# EasyEDA Pro project 2025新M0板子工程.eprj, board PCB1
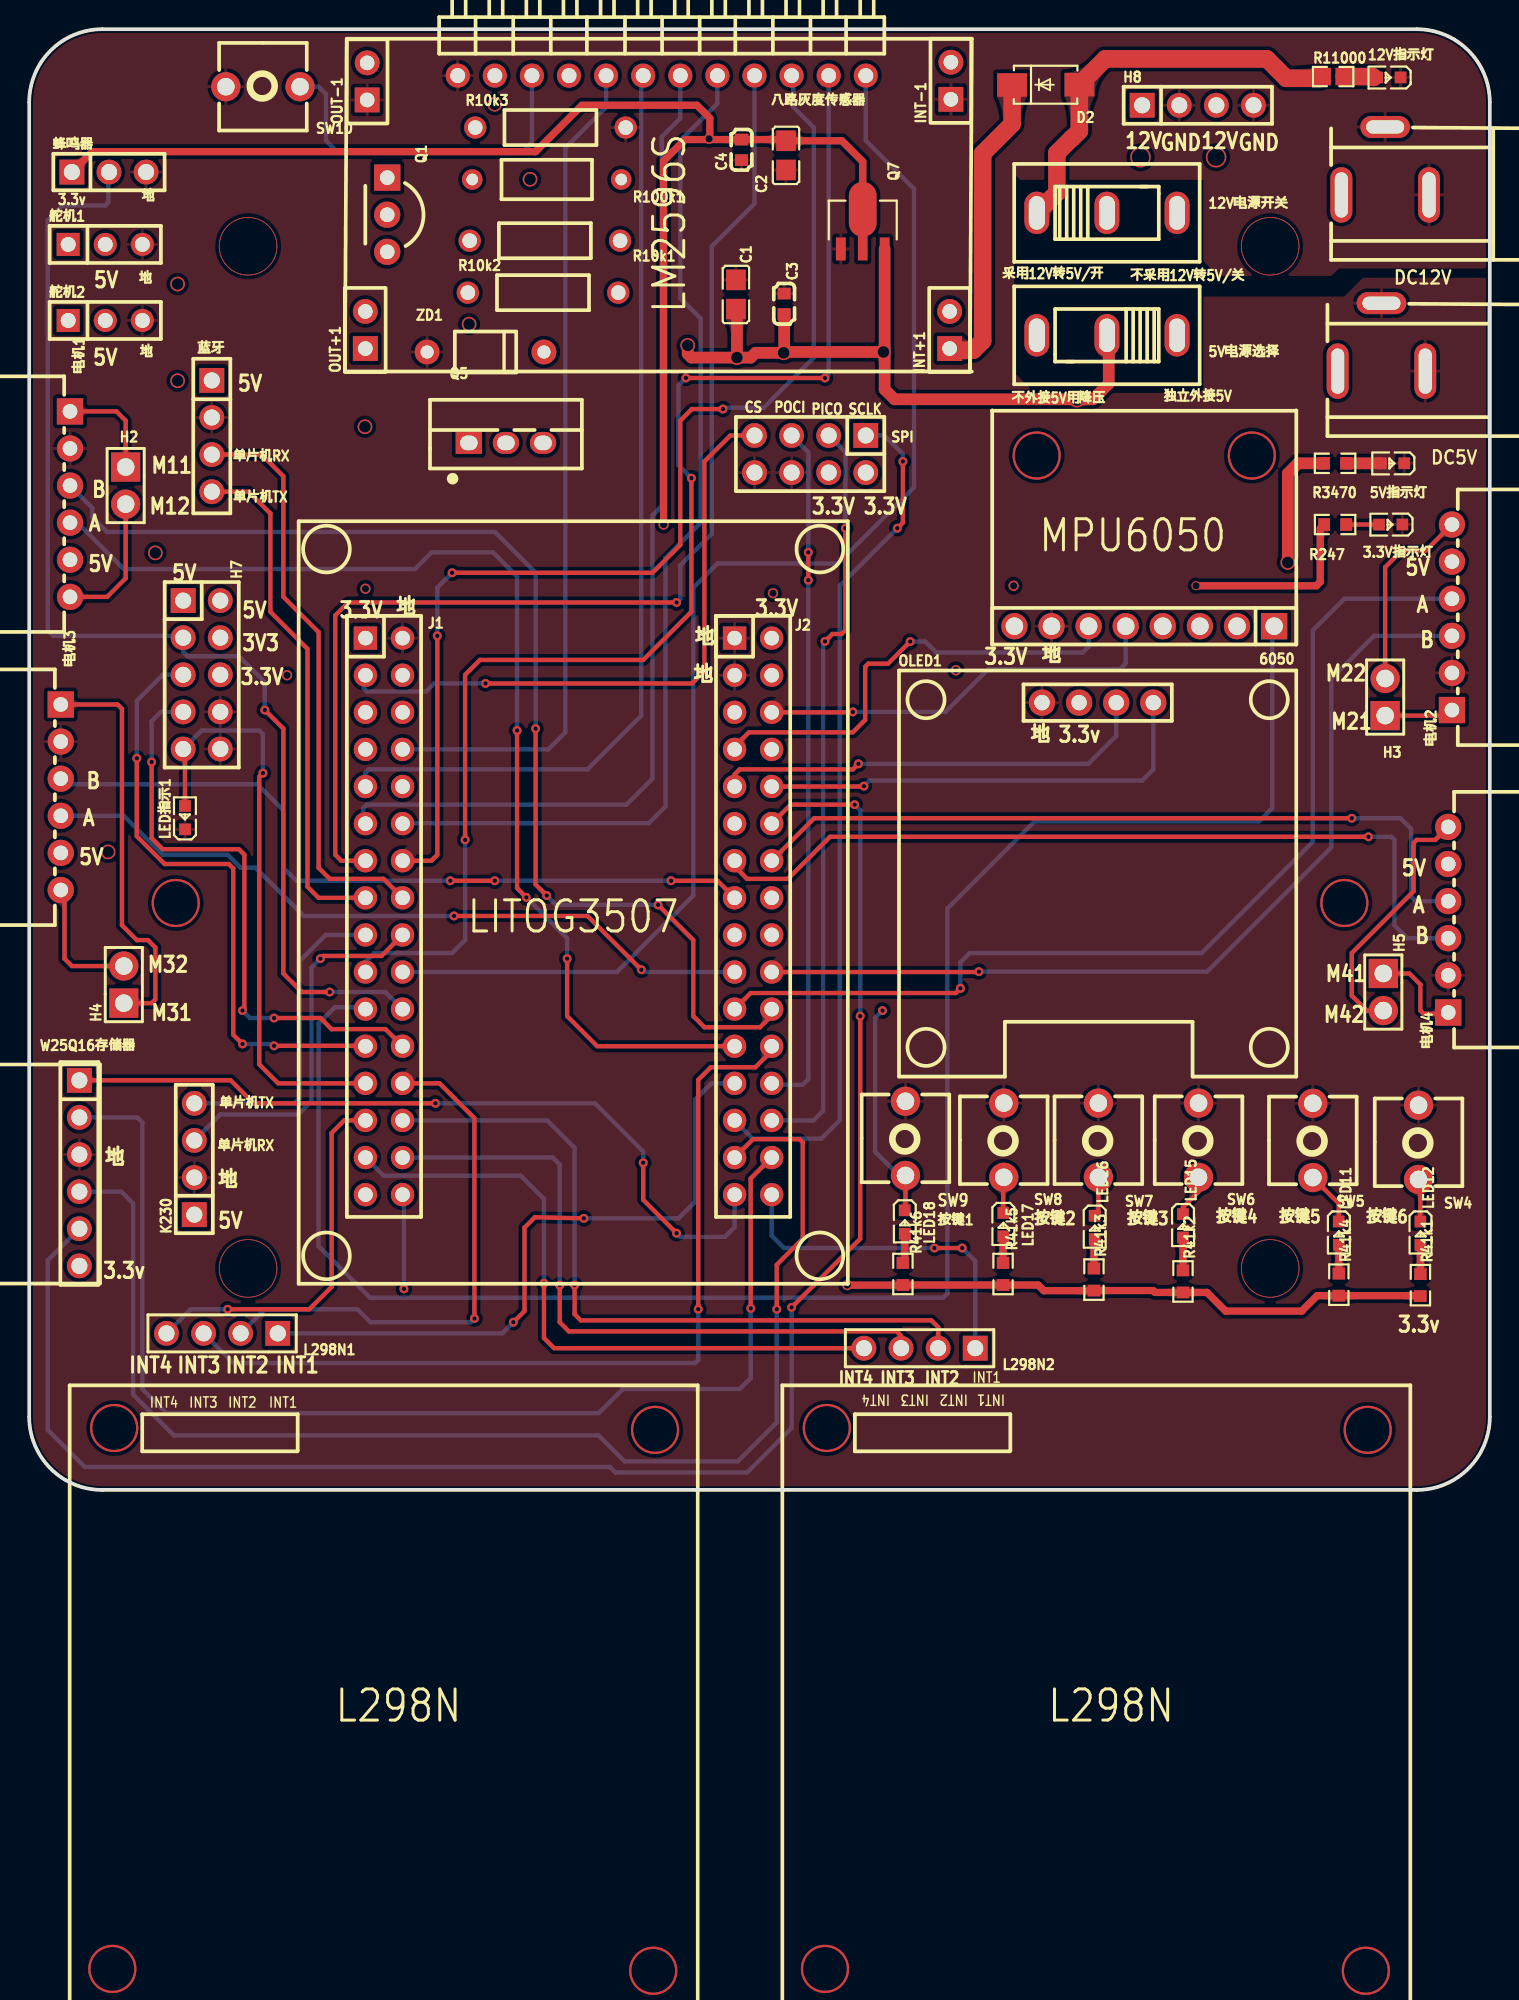
[diagram p1: board, top side]
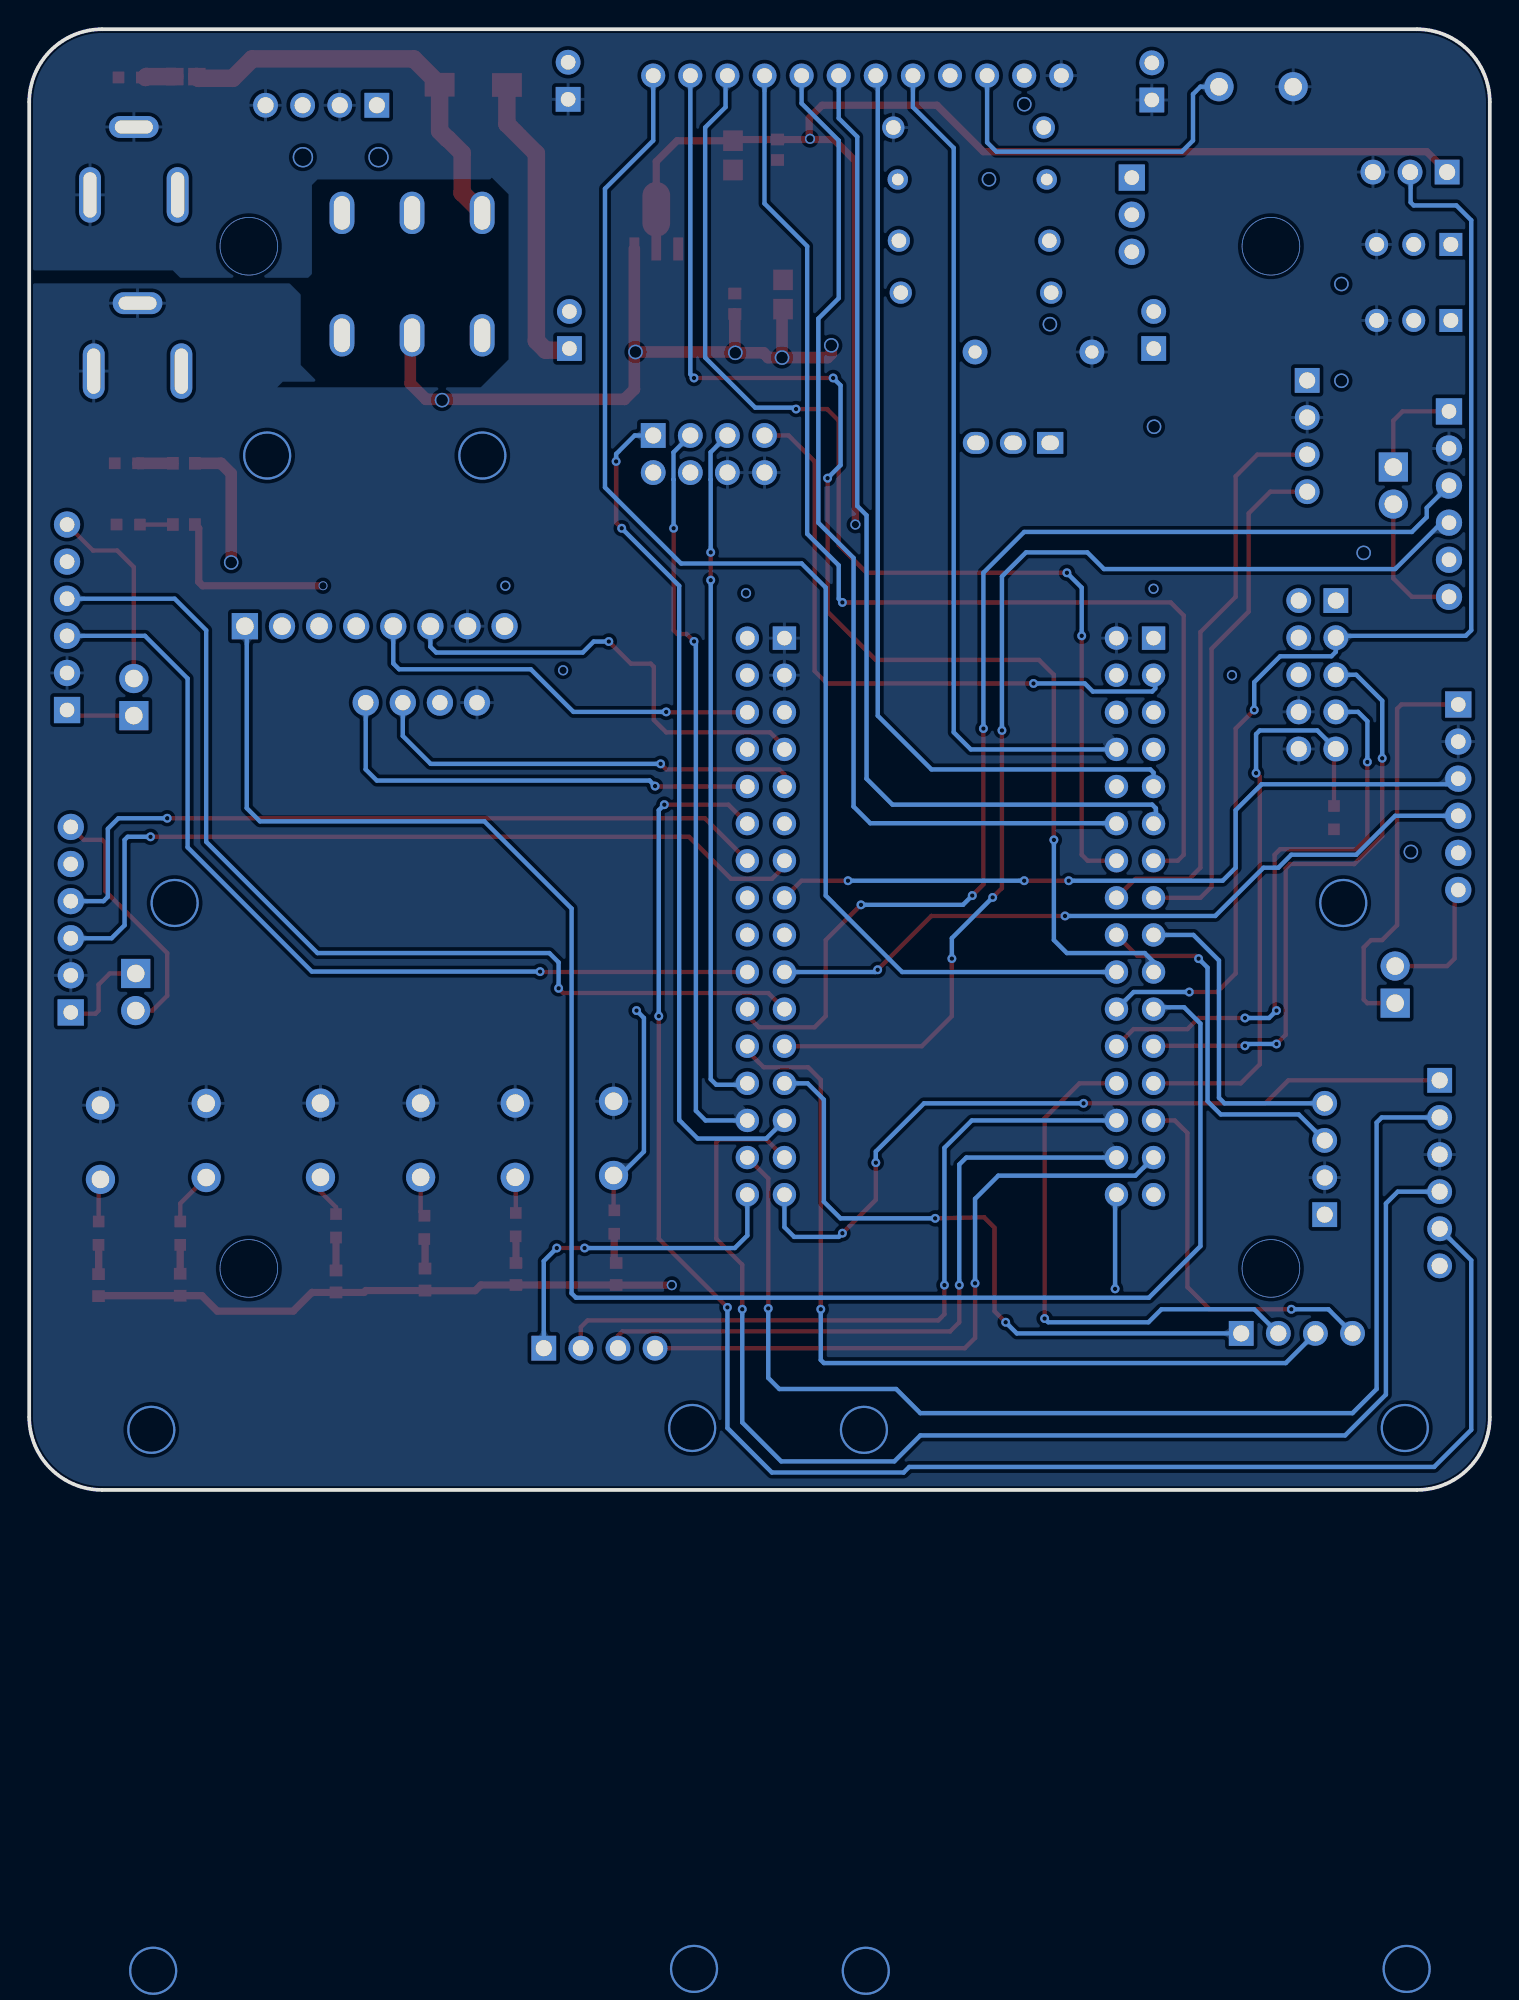
[diagram p2: board, bottom side, seen from below]

Outline 100 x 100 mm; copper layers: Top Layer, Inner1, Inner2, Bottom Layer. Coordinates in mm from the lower left corner of the outline.
Outline path: 0,95 0,5 arc(1.46,1.46) 5,0 95,0 arc(98.54,1.46) 100,5 100,95 arc(98.54,98.54) 95,100 5,100 arc(1.46,98.54) 0,95
Stack: Top Layer 0.035mm 外层铜厚1oz / Dielectric1 0.2104mm 7628 RC49% 8.6mil / Inner1 0.0152mm 内层铜厚 / Dielectric2 1.065mm 1.1mm H/HOZ Copper / Inner2 0.0152mm 内层铜厚 / Dielectric3 0.2104mm 7628 RC49% 8.6mil / Bottom Layer 0.035mm 外层铜厚1oz

## Design rules (mm)
template: 自定义配置
spacing copperThickness1oz (default): track to track 0.102, other pairs 0.152 to 0.3
spacing copperThickness2oz: track to track 0.203, other pairs 0.152 to 0.3
track width copperThickness1oz (default): min 0.254, default 0.3, max 2.54
track width copperThickness2oz: min 0.203, default 0.254, max 2.54
differential pair differentialPair (default): width min 0.127, default 0.254, max 2.54; gap min 0.152, default 0.152
via viaSize (default): diameter min 0.5, default 0.61, max 10; hole min 0.3, default 0.305, max 6.3

## Placement (name value [footprint] x y rotation side)
3.3V指示灯  LTST-C191KSKT  [LED0603-RD-YELLOW]  93.22 66.09 180 top
5V指示灯  LTST-C191KSKT  [LED0603-RD-YELLOW]  93.34 70.28 180 top
5V电源选择  SS12D10G5  [SW-TH_SHOU-HAN_SS12D10G4]  73.79 79.05 180 top
12V指示灯  LTST-C191KSKT  [LED0603-RD-YELLOW]  93.09 96.7 180 top
12V电源开关  SS12D10G5  [SW-TH_SHOU-HAN_SS12D10G4]  73.79 87.43 0 top
6050  2.54-1*8P母环保  [HDR-TH_8P-P2.54-V-F-1]  76.34 59.13 180 top
C1  10uF  [C0805]  48.39 81.84 270 top
C2  10uF  [C0805]  51.82 91.36 90 top
C3  100nF  [C0603]  51.69 81.2 270 top
C4  100nF  [C0603]  48.77 91.75 90 top
D2  SS54  [SMA_L4.3-W2.6-LS5.0-FD]  69.6 96.19 180 top
DC5V  DC005-T25  [DC-IN-TH_DC-005-20A-1]  92.58 78.92 180 top
DC12V  DC005-T25  [DC-IN-TH_DC-005-20A-1]  92.84 90.98 180 top
H2  PZ254V-11-02P  [HDR-TH_2P-P2.54-V-M]  6.6 68.76 270 top
H3  PZ254V-11-02P  [HDR-TH_2P-P2.54-V-M]  92.84 54.28 90 top
H4  PZ254V-11-02P  [HDR-TH_2P-P2.54-V-M]  6.48 34.59 90 top
H5  PZ254V-11-02P  [HDR-TH_2P-P2.54-V-M]  92.71 34.09 270 top
H7  PZ254V-12-10P  [HDR-TH_10P-P2.54-V-M-R2-C5-S2.54]  11.81 55.8 270 top
H8  PZ254V-11-04P  [HDR-TH_4P-P2.54-V-M]  80.01 94.79 0 top
INT+1  2.54-1*2P母  [HDR-TH_2P-P2.54-V-F]  63.02 79.41 90 top
INT-1  2.54-1*2P母  [HDR-TH_2P-P2.54-V-F]  63.1 96.47 90 top
J1  X6521FV-2x16-C85D32  [HDR-TH_32P-P2.54-V-F-R2-C16-S2.54]  24.29 39.27 270 top
J2  X6521FV-2x16-C85D32  [HDR-TH_32P-P2.54-V-F-R2-C16-S2.54]  49.56 39.27 270 top
K230  PZ254V-11-04P  [HDR-TH_4P-P2.54-V-M]  11.3 22.66 90 top
L298N1  2.54-1*4  [HDR-TH_4P-P2.54-V-M-1]  13.21 10.72 180 top
L298N2  2.54-1*4  [HDR-TH_4P-P2.54-V-M-1]  60.96 9.7 180 top
LED11  LTST-C191KSKT  [LED0603-RD-YELLOW]  89.66 17.58 270 top
LED12  LTST-C191KSKT  [LED0603-RD-YELLOW]  95.25 17.58 270 top
LED15  LTST-C191KSKT  [LED0603-RD-YELLOW]  78.99 18.09 270 top
LED16  LTST-C191KSKT  [LED0603-RD-YELLOW]  72.95 17.97 270 top
LED17  LTST-C191KSKT  [LED0603-RD-YELLOW]  66.69 18.16 270 top
LED18  LTST-C191KSKT  [LED0603-RD-YELLOW]  59.94 18.34 270 top
LED指示1  LTST-C191KSKT  [LED0603-RD-YELLOW]  10.67 46.03 90 top
OLED1  HS96L03W2C03  [OLED-TH_L27.8-W27.2-P2.54_C9900033791]  73.15 53.9 0 top
OUT+1  2.54-1*2P母  [HDR-TH_2P-P2.54-V-F]  23.01 79.41 90 top
OUT-1  2.54-1*2P母  [HDR-TH_2P-P2.54-V-F]  23.14 96.43 90 top
Q1  SS8550DTA  [TO-92-3_L4.8-W3.7-P2.54-L]  24.51 87.3 270 top
Q5  HSP3119  [TO-220-3_L10.2-W4.5-P2.54-L-1]  32.64 71.68 0 top
Q7  AMS1117-3.3V  [SOT-89-3_L4.5-W2.5-P1.50-LS4.2-BR]  57.07 86.31 270 top
R10k1  10kΩ  [RES-TH_BD2.4-L6.3-P10.30-D0.6]  35.31 85.52 180 top
R10k2  10kΩ  [RES-TH_BD2.4-L6.3-P10.30-D0.6]  35.18 81.97 0 top
R10k3  10kΩ  [RES-TH_BD2.4-L6.3-P10.30-D0.6]  35.69 93.27 0 top
R41k1  1kΩ  [R0603]  95.25 14.02 270 top
R41k2  1kΩ  [R0603]  78.99 14.28 270 top
R41k3  1kΩ  [R0603]  72.9 14.4 270 top
R41k4  1kΩ  [R0603]  89.66 14.05 270 top
R41k5  1kΩ  [R0603]  66.68 14.78 270 top
R41k6  1kΩ  [R0603]  59.82 14.78 270 top
R100k1  100kΩ  [RES-TH_BD2.7-L6.2-P10.20-D0.4]  35.43 89.71 180 top
R247  470Ω  [R0603]  89.41 66.09 0 top
R3470  470Ω  [R0603]  89.41 70.28 0 top
R11000  470Ω  [R0603#2]  89.28 96.76 0 top
SPI  PZ254V-12-8P  [HDR-TH_8P-P2.54-V-M-R2-C4-S2.54]  53.47 70.92 180 top
SW4  K2-1104DZ-G4SW-04  [KEY-TH_2P-L6.0-W6.0-P5.00]  95.12 23.8 270 top
SW5  K2-1104DZ-G4SW-04  [KEY-TH_2P-L6.0-W6.0-P5.00]  87.88 23.93 270 top
SW6  K2-1104DZ-G4SW-04  [KEY-TH_2P-L6.0-W6.0-P5.00]  80.06 23.94 270 top
SW7  K2-1104DZ-G4SW-04  [KEY-TH_2P-L6.0-W6.0-P5.00]  73.2 23.94 270 top
SW8  K2-1104DZ-G4SW-04  [KEY-TH_2P-L6.0-W6.0-P5.00]  66.72 23.94 270 top
SW10  K2-1104DZ-G4SW-04  [KEY-TH_2P-L6.0-W6.0-P5.00]  16 96.06 180 top
W25Q16存储器  PZ254V-11-06P  [HDR-TH_6P-P2.54-V-M]  3.43 21.69 270 top
ZD1  1N4734A  [DO-41_BD2.8-L4.2-P8.00-D0.7-FD]  31.24 77.9 0 top
八路灰度传感器  2.54-1*12P反弯针  [HDR-TH_12P-P2.54-H-M-W10.5]  43.31 96.83 180 top
按键1  K2-1104DZ-G4SW-04  [KEY-TH_2P-L6.0-W6.0-P5.00]  59.99 24.07 270 top
电机1  XH-6AW  [CONN-TH_6P-P2.54_HCTL_XH-6AW_C2908615]  2.79 67.49 270 top
电机2  XH-6AW  [CONN-TH_6P-P2.54_HCTL_XH-6AW_C2908615]  97.41 59.74 90 top
电机3  XH-6AW  [CONN-TH_6P-P2.54_HCTL_XH-6AW_C2908615]  2.16 47.42 270 top
电机4  XH-6AW  [CONN-TH_6P-P2.54_HCTL_XH-6AW_C2908615]  97.16 39.04 90 top
舵机1  舵机  [HDR-TH_3P-P2.54-V-F]  5.21 85.27 0 top
舵机2  舵机  [HDR-TH_3P-P2.54-V-F]  5.21 80.06 0 top
蓝牙  2.54-1*4P母  [HDR-TH_4P-P2.54-V-F]  12.5 72.15 270 top
蜂鸣器  PZ254V-11-03P  [HDR-TH_3P-P2.54-V-M]  5.46 90.22 0 top

## Footprints (pads in the part's own frame, mm; a bottom-side part is the same pattern mirrored in y, then rotated)
C0603
  rect 0.8x0.9 smd: 1(-0.7,0) 2(0.7,0)
C0805
  rect 1.41x1.35 smd: 1(-1,0) 2(1,0)
CONN-TH_6P-P2.54_HCTL_XH-6AW_C2908615
  rect 1.8x1.8 hole 1: 1(-6.35,0)
  round 1.8 hole 1: 2(-3.81,0) 3(-1.27,0) 4(1.27,0) 5(3.81,0) 6(6.35,0)
DC-IN-TH_DC-005-20A-1
  oval 1.5x3.8 hole 0.9x3.1: 1(3,2.325) 2(-3,2.325)
  oval 3.4x1.5 hole 2.6x0.9: 3(0,-2.325)
DO-41_BD2.8-L4.2-P8.00-D0.7-FD
  round 1.7 hole 0.9: 1(-4,0) 2(4,0)
HDR-TH_2P-P2.54-V-F
  rect 1.7x1.7 hole 1: 1(-1.27,0)
  round 1.7 hole 1: 2(1.27,0)
HDR-TH_2P-P2.54-V-M
  rect 2x2 hole 1.2: 1(-1.27,0)
  round 2 hole 1.2: 2(1.27,0)
HDR-TH_3P-P2.54-V-F
  rect 1.575x1.575 hole 1.02: 1(-2.54,0)
  round 1.575 hole 1.02: 2(0,0) 3(2.54,0)
HDR-TH_3P-P2.54-V-M
  rect 1.7x1.7 hole 1.1: 1(-2.54,0)
  round 1.7 hole 1.1: 2(0,0) 3(2.54,0)
HDR-TH_4P-P2.54-V-F
  rect 1.7x1.7 hole 1.1: 1(-3.81,0)
  round 1.7 hole 1.1: 2(-1.27,0) 3(1.27,0) 4(3.81,0)
HDR-TH_4P-P2.54-V-M
  rect 1.7x1.7 hole 1.1: 1(-3.81,0)
  round 1.7 hole 1.1: 2(-1.27,0) 3(1.27,0) 4(3.81,0)
HDR-TH_4P-P2.54-V-M-1
  rect 1.7x1.7 hole 1.1: 1(-3.81,0)
  round 1.7 hole 1.1: 2(-1.27,0) 3(1.27,0) 4(3.81,0)
HDR-TH_6P-P2.54-V-M
  rect 1.7x1.7 hole 1.1: 1(-6.35,0)
  round 1.7 hole 1.1: 2(-3.81,0) 3(-1.27,0) 4(1.27,0) 5(3.81,0) 6(6.35,0)
HDR-TH_8P-P2.54-V-F-1
  rect 1.8x1.8 hole 1.2: 1(-8.89,0)
  round 1.8 hole 1.2: 2(-6.35,0) 3(-3.81,0) 4(-1.27,0) 5(1.27,0) 6(3.81,0) 7(6.35,0) 8(8.89,0)
HDR-TH_8P-P2.54-V-M-R2-C4-S2.54
  rect 1.7x1.7 hole 1.1: 1(-3.81,-1.27)
  round 1.7 hole 1.1: 2(-3.81,1.27) 3(-1.27,-1.27) 4(-1.27,1.27) 5(1.27,-1.27) 6(1.27,1.27) 7(3.81,-1.27) 8(3.81,1.27)
HDR-TH_10P-P2.54-V-M-R2-C5-S2.54
  rect 1.7x1.7 hole 1.1: 1(-5.08,-1.27)
  round 1.7 hole 1.1: 2(-5.08,1.27) 3(-2.54,-1.27) 4(-2.54,1.27) 5(0,-1.27) 6(0,1.27) 7(2.54,-1.27) 8(2.54,1.27) 9(5.08,-1.27) 10(5.08,1.27)
HDR-TH_12P-P2.54-H-M-W10.5
  round 1.65 hole 1.02: 1(-13.97,0) 2(-11.43,0) 3(-8.89,0) 4(-6.35,0) 5(-3.81,0) 6(-1.27,0) 7(1.27,0) 8(3.81,0) 9(6.35,0) 10(8.89,0) 11(11.43,0) 12(13.97,0)
HDR-TH_32P-P2.54-V-F-R2-C16-S2.54
  rect 1.6x1.6 hole 1: 1(-19.05,-1.27)
  round 1.6 hole 1: 2(-19.05,1.27) 3(-16.51,-1.27) 4(-16.51,1.27) 5(-13.97,-1.27) 6(-13.97,1.27) 7(-11.43,-1.27) 8(-11.43,1.27) 9(-8.89,-1.27) 10(-8.89,1.27) 11(-6.35,-1.27) 12(-6.35,1.27) 13(-3.81,-1.27) 14(-3.81,1.27) 15(-1.27,-1.27) 16(-1.27,1.27) 17(1.27,-1.27) 18(1.27,1.27) 19(3.81,-1.27) 20(3.81,1.27) 21(6.35,-1.27) 22(6.35,1.27) 23(8.89,-1.27) 24(8.89,1.27) 25(11.43,-1.27) 26(11.43,1.27) 27(13.97,-1.27) 28(13.97,1.27) 29(16.51,-1.27) 30(16.51,1.27) 31(19.05,-1.27) 32(19.05,1.27)
KEY-TH_2P-L6.0-W6.0-P5.00
  round 2 hole 1.2: 1(-2.54,0) 2(2.54,0)
LED0603-RD-YELLOW
  rect 0.8x0.8 smd: 1(-0.799,-0.004) 2(0.799,0.004)
OLED-TH_L27.8-W27.2-P2.54_C9900033791
  round 1.8 hole 1.05: 1(-3.81,0) 2(-1.27,0) 3(1.27,0) 4(3.81,0)
R0603
  rect 0.806x0.864 smd: 1(-0.753,0) 2(0.753,0)
R0603#2
  rect 1.2x1.2 smd: 1(-0.753,0) 2(0.753,0)
RES-TH_BD2.4-L6.3-P10.30-D0.6
  round 1.524 hole 1: 1(-5.15,0) 2(5.15,0)
RES-TH_BD2.7-L6.2-P10.20-D0.4
  round 1.4 hole 0.8: 1(-5.1,0) 2(5.1,0)
SMA_L4.3-W2.6-LS5.0-FD
  rect 2.046x1.62 smd: 1(-2.304,-0.009) 2(2.304,0.009)
SOT-89-3_L4.5-W2.5-P1.50-LS4.2-BR
  rect 1.575x0.672 smd: 1(1.356,-1.5) 3(1.356,1.5)
  custom 5.377x1.9 smd: 2(-1.356,0)
SW-TH_SHOU-HAN_SS12D10G4
  oval 1.7x2.9 hole 1.1x2.3: 1(-4.8,0) 2(0,0) 3(4.8,0)
TO-92-3_L4.8-W3.7-P2.54-L
  rect 1.8x1.8 hole 1: 1(-2.54,0)
  round 1.8 hole 1: 2(0,0) 3(2.54,0)
TO-220-3_L10.2-W4.5-P2.54-L-1
  rect 1.8x1.5 hole 1.2x1: 1(-2.54,0)
  oval 1.8x1.5 hole 1.2x1: 2(0,0) 3(2.54,0)

## Nets
As in the schematic, except:
3V3: 6050.8 C2.2 C4.2 H7.4 H7.6 J1.1 J2.2 OLED1.2 Q7.2 R41k1.2 R41k2.2 R41k3.2 R41k4.2 R41k5.2 R41k6.2 R247.1 SPI.2 SPI.4 W25Q16存储器.6 蜂鸣器.1
5V1: 5V电源选择.1 DC5V.1
12V: 12V电源开关.1 D2.1 R11000.1
GND: 3.3V指示灯.1 5V指示灯.1 12V指示灯.1 6050.7 C1.1 C2.1 C3.1 C4.1 DC5V.2 DC5V.3 DC12V.2 DC12V.3 H7.8 H7.10 H8.2 H8.4 INT-1.1 J1.2 J2.1 J2.3 K230.2 LED指示1.1 OLED1.1 OUT-1.1 Q7.1 R10k3.2 SPI.6 SPI.8 SW4.1 SW5.1 SW6.1 SW7.1 SW8.1 SW10.2 W25Q16存储器.3 ZD1.1 八路灰度传感器.12 按键1.1 电机1.2 电机2.2 电机3.2 电机4.2 舵机1.3 舵机2.3 蓝牙.2 蜂鸣器.3
V12: 12V电源开关.2 DC12V.1 H8.1 H8.3
PA31: J2.4 LED18.1 按键1.2
$1N6143: 3.3V指示灯.2 R247.2
$1N6144: 12V指示灯.2 R11000.2
$1N6148: 5V指示灯.2 R3470.2

Pads without a net: 12V电源开关 3; 6050 2 3 4; INT+1 2; INT-1 2; OUT+1 2; OUT-1 2

## Via types
v1: diameter 3.3, hole 3, Top Layer to Bottom Layer, 12 vias
v2: diameter 4, hole 3.9, Top Layer to Bottom Layer, 4 vias
v3: diameter 0.61, hole 0.305, Top Layer to Bottom Layer, 64 vias
v4: diameter 0.7, hole 0.5, Top Layer to Bottom Layer, 8 vias
v5: diameter 0.61, hole 0.5, Top Layer to Bottom Layer, 1 via
v6: diameter 1, hole 0.8, Top Layer to Bottom Layer, 14 vias
v7: diameter 1.4, hole 1.2, Top Layer to Bottom Layer, 2 vias

## Routing (per net, layer and track width the routed paths; a pad name or vN(x,y) marks a point on that pad's centre or on a via; arc(x,y) is an arc through that point)
3V3: length 398.8
  Top Layer w0.5: 46.6,92.44 51.74,92.44 C2.2 55.64,92.36 57.07,90.94 Q7.2 ; 46.6,92.44 44.9,92.44 43.43,90.98 v4(43.43,66.09) ; 46.6,92.44 46.6,93.92 45.72,94.79 37.85,94.79 34.67,91.62 4.32,91.62 蜂鸣器.1 ; v4(56.01,14.02) 59.81,14.02 R41k6.2 R41k5.2 69.08,14.03 69.47,13.64 72.89,13.64 R41k3.2 76.95,13.65 77.08,13.52 R41k2.2 80.64,13.52 81.91,12.24 87.12,12.24 88.18,13.3 R41k4.2 95.22,13.3 R41k1.2 ; v5(79.88,61.9) 88.13,61.9 88.39,62.16 88.39,65.83 R247.1
  Inner1 w0.5: v4(67.4,61.9) v5(79.88,61.9) ; v4(67.4,61.9) 65.91,61.9 64.64,63.17 51.44,63.17 50.92,62.66 v4(50.92,61.39) ; v4(67.4,61.9) 67.45,61.85 6050.8 ; v4(17.65,55.77) 17.65,19.61 20.95,16.31 20.95,9.07 18.8,6.91 6.35,6.91 3.43,9.83 W25Q16存储器.6 ; v4(17.65,55.77) 17.62,55.8 H7.6 13.02,55.86 13.02,58.28 H7.4 ; v4(17.65,55.77) 17.65,59.49 19.86,61.7 v4(23.02,61.7) ; v4(23.02,61.7) J1.1 ; v4(23.02,61.7) 23.02,64.98 24.13,66.09 v4(43.43,66.09) ; 57.28,69.65 54.74,69.65 54.61,69.52 54.61,66.73 53.97,66.09 v4(43.43,66.09) ; v4(43.43,66.09) 43.43,63.68 45.72,61.39 v4(50.92,61.39) ; v4(63.45,56.11) 63.5,56.06 71.67,56.06 71.88,55.85 OLED1.2 ; v4(63.45,56.11) 59.89,56.11 54.61,61.39 v4(50.92,61.39) ; v4(63.45,56.11) 63.45,53.97 60.32,50.85 60.32,31.67 59.06,30.4 55.88,30.4 55.53,30.05 55.53,14.5 v4(56.01,14.02) ; J2.2 50.92,58.41 v4(50.92,61.39)
  vias: v4(46.54,92.5)
5V: length 298.8
  Top Layer w0.8: R3470.1 86.87,70.28 86.17,69.58 v6(86.17,63.49) ; v6(48.46,77.52) 49.4,77.52 49.73,77.85 v6(51.66,77.85) ; v6(48.46,77.52) 48.46,80.77 C1.2 ; v6(48.46,77.52) 45.34,77.52 45.09,77.78 v6(45.09,78.36) ; C3.2 51.69,77.96 51.75,77.9 v6(58.49,77.9) ; 5V电源选择.2 73.91,78.92 73.91,75.74 72.83,74.66 59.25,74.66 58.57,75.34 Q7.3
  Inner1 w0.8: 31.88,94.92 八路灰度传感器.11 ; 31.88,94.92 31.88,94.87 v6(31.87,94.86) ; 31.88,94.92 43.05,94.92 45.09,92.89 v6(45.09,78.36) ; 31.88,94.92 28.19,94.92 27.05,93.78 27.05,92.76 26.03,91.75 12.57,91.75 10.8,89.97 10.8,82.56 v6(10.16,82.56) ; v6(10.16,75.93) 10.16,66.73 8.64,65.2 v6(8.64,64.15) ; v6(10.16,75.93) 12.48,75.93 蓝牙.1 ; v6(10.16,75.93) 6.54,75.93 5.15,77.32 5.15,80 舵机2.2 ; v6(10.16,75.93) v6(10.16,82.56) ; 舵机1.2 5.21,82.86 5.51,82.56 v6(10.16,82.56) ; 电机2.5 72.77,63.55 71.73,64.59 v6(71.73,74.61) ; v6(5.4,43.68) 5.4,39.62 2.79,37.01 2.79,30.91 3.36,30.35 6.22,30.35 7.49,29.08 7.49,19.48 8.38,18.59 11.05,18.59 K230.1 ; v6(5.4,43.68) 5.34,43.61 电机3.5 ; v6(5.4,43.68) 5.4,61.84 5.97,62.41 7.87,62.41 8.64,63.17 v6(8.64,64.15) ; v6(8.64,64.15) 12.34,64.15 13.21,63.28 13.21,61.01 H7.2 10.54,60.88 ; v6(8.64,64.15) 3.27,64.15 电机1.5 ; v6(86.17,63.49) 86.23,63.43 86.23,62.15 87,61.39 88.52,61.39 89.37,60.55 89.37,44.42 90.93,42.85 电机4.5
5V1: length 12
  Inner1 w0.8: DC5V.1 85.76,76.59 83.31,79.05 5V电源选择.1
5V2: length 59.6
  Inner1 w0.8: Q5.3 35.18,68.89 34.54,68.25 23.88,68.25 22.99,69.14 v6(22.99,72.78) ; R10k1.2 30.48,85.85 30.48,89.57 R100k1.2 30.21,89.84 Q1.1 21.84,89.84 18.92,86.92 18.92,73.2 19.34,72.78 v6(22.99,72.78) ; OUT+1.1 22.99,78.11 v6(22.99,72.78)
5V3: length 42.2
  Inner1 w0.8: 5V电源选择.3 68.99,75.9 67.94,74.85 34.16,74.85 32.64,73.33 Q5.2
12V: length 27.9
  Top Layer w1.2: R11000.1 88.41,96.64 86.06,96.64 84.74,97.97 73.67,97.97 D2.1 71.9,93.03 71.37,92.51 71.35,92.51 70.36,91.52 70.36,88.8 12V电源开关.1
V12: length 27.7
  Inner1 w1.2: v7(81.26,91.24) v7(76.09,91.24) ; v7(81.26,91.24) 81.26,94.77 H8.3 ; v7(81.26,91.24) 85.6,91.24 88.18,88.66 DC12V.1 ; v7(76.09,91.24) 76.09,94.68 H8.1 ; v7(76.09,91.24) 74.42,91.24 73.79,90.6 12V电源开关.2
(no net):
  vias: v1(5.69,-32.79) v1(5.82,4.24) v1(10.03,40.18) v1(42.72,-32.92) v1(42.85,4.11) v1(54.48,-32.79) v1(54.61,4.24) v1(68.98,70.81) v1(83.71,70.81) v1(90.04,40.18) v1(91.51,-32.92) v1(91.64,4.12) v2(14.99,85.14) v2(14.99,15.16) v2(84.96,85.14) v2(84.96,15.16)
1: length 10.8
  Inner1 w0.8: ZD1.2 36.96,77.9 40.33,81.27 R10k2.2 40.46,82.09 R10k1.1
2: length 9.7
  Inner1 w0.8: R10k2.1 28.45,81.97 27.69,82.73 27.69,86.16 26.54,87.3 Q1.2
3: length 42.9
  Inner1 w0.8: v6(34.29,89.73) 34.29,82.09 32,79.81 v6(30.12,79.81) ; v6(34.29,89.73) 40.52,89.73 R100k1.1 ; v6(34.29,89.73) 34.29,92.51 33.66,93.14 30.66,93.14 R10k3.1 ; v6(30.12,79.81) 27.31,79.81 25.93,81.19 25.93,83.34 Q1.3 ; v6(30.12,79.81) 30.1,79.79 30.1,71.68
KEY: length 24.4
  Bottom Layer w0.3: 八路灰度传感器.10 34.42,92.25 33.78,91.62 21.08,91.62 20.32,92.38 20.32,95.56 19.81,96.06 SW10.1
M11: length 7.2
  Top Layer w0.3: H2.1 6.6,73.2 5.97,73.84 电机1.1
M12: length 9.4
  Top Layer w0.3: H2.2 6.6,62.41 5.33,61.14 电机1.6
M21: length 4.7
  Top Layer w0.3: 电机2.1 97.03,53.01 H3.1
M22: length 13.4
  Top Layer w0.3: H3.2 92.84,63.17 93.98,64.31 95.63,64.31 电机2.6
M31: length 27.9
  Top Layer w0.3: H4.1 8.38,33.33 8.64,33.58 8.64,37.14 8.13,37.64 7.37,37.64 6.35,38.66 6.35,53.47 6.05,53.77 电机3.1
M32: length 9.1
  Top Layer w0.3: H4.2 2.92,35.86 2.41,36.37 2.41,40.82 电机3.6
M41: length 6.7
  Top Layer w0.3: H5.1 94.49,35.36 95.25,34.59 95.25,32.82 95.46,32.61 97.07,32.61 电机4.1
M42: length 17.6
  Top Layer w0.3: 电机4.6 96.27,44.5 95,44.5 94.78,44.29 94.78,40.99 90.55,36.75 90.55,33.83 91.57,32.82 H5.2
PA0: length 31.2
  Top Layer w0.3: v3(57.15,48.18) 57.12,48.16 J2.10
  Bottom Layer w0.3: v3(57.15,48.18) 57.53,48.56 76.2,48.56 76.96,49.33 OLED1.4
PA1: length 30.3
  Top Layer w0.3: J2.9 48.29,48.98 48.64,49.33 56.39,49.33 v3(56.77,49.71)
  Bottom Layer w0.3: OLED1.3 74.42,51.61 72.52,49.71 v3(56.77,49.71)
PA2: length 43.5
  Top Layer w0.3: v3(31.24,55.21) 45.38,55.21 46.23,56.06 46.23,70.41 48.01,72.19 SPI.7
  Bottom Layer w0.3: J1.3 22.9,55.66 22.9,54.87 23.11,54.66 27.18,54.66 27.73,55.21 v3(31.24,55.21)
PA8: length 35.5
  Top Layer w0.3: 蓝牙.4 15.02,68.34 16.51,66.85 16.51,60.12 19.05,57.58 19.05,41.3 19.81,40.54 J1.15
PA9: length 39.9
  Top Layer w0.3: 蓝牙.3 15.91,70.88 17.4,69.39 17.4,61.14 19.81,58.72 19.81,42.6 20.57,41.83 24.26,41.83 J1.16
PA10: length 22
  Bottom Layer w0.3: J1.17 20.29,38 18.54,36.25 18.54,26.85 18.16,26.47 K230.4
PA11: length 25.4
  Top Layer w0.3: J1.18 24.12,36.56 20.12,36.56 v3(19.94,36.37)
  Bottom Layer w0.3: v3(19.94,36.37) 19.33,35.76 19.33,26.62 18.42,25.71 13.08,25.71 K230.3
PA12: length 46.4
  Top Layer w0.3: v3(36.32,14.02) 36.32,11.48 36.95,10.85 59.39,10.85 59.69,10.56 L298N2.3
  Bottom Layer w0.3: J1.30 35.84,22.76 36.32,22.28 v3(36.32,14.02)
PA13: length 82.2
  Top Layer w0.3: SW5.2 89.66,19.61 LED11.1
  Inner2 w0.3: SW5.2 83.95,21.39 81.28,18.72 81.28,12.75 80.39,11.86 54.36,11.86 53.72,11.23 37.34,11.23 35.94,12.62 33.4,12.62 31.37,14.66 24.89,14.66 23.02,16.53 J1.31
PA14: length 94.5
  Top Layer w0.3: SW4.2 95.25,21.14 LED12.1
  Inner2 w0.3: SW4.2 93.47,21.26 92.84,20.62 92.84,13.13 87.12,7.42 27.18,7.42 25.65,8.94 v3(25.65,13.77)
  Bottom Layer w0.3: v3(25.65,13.77) 25.65,20.12 J1.32
PA15: length 23.4
  Top Layer w0.3: v3(61.98,16.56) v3(63.88,16.56)
  Bottom Layer w0.3: L298N2.1 64.77,15.67 v3(63.88,16.56) ; J2.32 50.83,17.42 51.69,16.56 v3(61.98,16.56)
PA16: length 53.7
  Top Layer w0.3: v3(44.32,17.58) 42.04,19.86 v3(42.04,22.4) ; W25Q16存储器.1 13.79,28.04 15.37,26.47 v3(27.81,26.47)
  Bottom Layer w0.3: v3(42.04,22.4) 42.04,23.16 38.74,26.47 v3(27.81,26.47) ; v3(44.32,17.58) 44.58,17.32 47.62,17.32 48.29,17.99 J2.31
PA17: length 81.7
  Top Layer w0.3: J2.30 49.4,21.32 49.4,12.43 v3(49.4,12.43)
  Bottom Layer w0.3: v3(49.4,12.43) 49.4,7.67 48.64,6.91 40.64,6.91 38.99,5.26 9.4,5.26 7.75,6.91 7.75,25.15 7.4,25.5 W25Q16存储器.2
PA18: length 89.4
  Top Layer w0.3: J2.29 49.55,24.01 52.75,24.01 52.96,23.8 52.96,17.2 51.18,15.42 v3(51.18,12.37)
  Bottom Layer w0.3: v3(51.18,12.37) 51.18,4.62 48.51,1.96 40.77,1.96 38.99,3.73 9.91,3.73 7.11,6.53 7.11,19.61 6.3,20.42 W25Q16存储器.4
PA21: length 45.8
  Top Layer w0.3: v3(37.97,18.59) 34.62,18.67 33.91,17.96 33.91,12.24 v3(33.15,11.48)
  Bottom Layer w0.3: J2.25 46.71,27.84 45.59,26.72 45.59,19.74 44.45,18.59 v3(37.97,18.59) ; L298N1.1 32.38,10.72 v3(33.15,11.48)
PA22: length 60.1
  Top Layer w0.3: J2.24 50.83,30.06 49.71,28.94 46.67,28.94 45.81,28.08 v3(45.81,12.37)
  Bottom Layer w0.3: v3(45.81,12.37) 45.81,8.9 45.59,8.69 13.97,8.69 L298N1.3
PA23: length 78.1
  Top Layer w0.3: LED15.1 78.99,19.35 80.06,20.42 SW6.2
  Inner2 w0.3: SW6.2 79.19,22.28 76.96,22.28 75.56,20.88 75.56,15.04 74.29,13.77 57.18,13.77 54.39,16.56 43.69,16.56 40.64,19.61 40.64,30.91 44.83,35.1 44.83,36.75 45.72,37.64 47.06,37.64 47.81,36.89 48.75,36.89 49.5,37.64 49.72,37.64 50.07,38 J2.18
PA24: length 77.9
  Inner2 w0.3: 2.67,80.06 2.67,78.79 3.56,77.9 15.49,77.9 17.78,75.62 17.78,68.38 22.1,64.06 37.97,64.06 40.26,61.77 40.26,52.88 46.23,46.91 46.23,39.04 47.27,38 J2.17
PA25: length 46.1
  Top Layer w0.3: LED16.1 73.2,19.03 SW7.2
  Inner2 w0.3: SW7.2 72.71,21.9 72.14,21.9 69.6,19.35 54.74,19.35 52.92,21.17 52.92,39.84 52.19,40.57 50.87,40.57 J2.16
PA26: length 119.1
  Top Layer w0.3: v3(56.51,46.91) 52.13,46.91 J2.12 ; v3(52.2,12.5) 56.9,17.2 v3(56.9,32.44)
  Bottom Layer w0.3: W25Q16存储器.5 1.27,15.72 1.27,4.12 3.81,1.57 39.75,1.57 40.13,1.19 49.15,1.19 52.2,4.24 v3(52.2,12.5) ; v3(56.9,32.44) 56.9,46.53 v3(56.51,46.91)
PA27: length 44.3
  Top Layer w0.3: LED17.1 66.69,21.36 SW8.2
  Inner2 w0.3: J2.11 48.29,45.93 49.28,46.91 52.58,46.91 53.72,45.77 53.72,25.07 55.37,23.42 64.71,23.42 SW8.2
PA28: length 73.4
  Inner2 w0.3: J2.8 50.83,50.94 49.78,51.99 44.2,51.99 41.4,54.79 41.4,64.19 40.39,65.2 23.24,65.2 18.8,69.65 18.8,76.12 13.84,81.08 9.65,81.08 8.64,82.09 3.3,82.09 2.67,82.73 2.67,85.27
PA29: length 31.4
  Top Layer w0.3: J2.7 48.29,50.88 49.28,51.87 56.39,51.87 57.24,52.71 57.24,56.35 57.45,56.57 58.8,56.57 v3(60.32,58.08)
  Bottom Layer w0.3: v3(60.32,58.08) 61.35,58.08 62.1,57.33 72.14,57.33 72.53,57.72 6050.6
PA30: length 28.2
  Top Layer w0.3: J2.6 56.36,53.24 v3(56.39,53.26)
  Bottom Layer w0.3: v3(56.39,53.26) 62.74,53.26 65.66,56.19 74.68,56.19 75.07,56.58 6050.5
PA31: length 45.6
  Top Layer w0.3: 按键1.2 59.99,19.19 LED18.1
  Inner2 w0.3: v3(58.42,32.82) 59.18,33.58 59.18,53.9 58.8,54.28 54.36,54.28 52.86,55.78 J2.4
  Bottom Layer w0.3: 按键1.2 59.55,21.53 57.91,23.16 57.91,32.31 v3(58.42,32.82)
PB0: length 57.7
  Bottom Layer w0.3: 八路灰度传感器.8 39.5,94.67 36.7,91.87 36.7,51.87 35.53,50.7 J1.8
PB1: length 65.3
  Bottom Layer w0.3: 八路灰度传感器.7 41.9,96.69 41.9,53 38.23,49.33 23.24,49.33 23.02,49.11 J1.9
PB2: length 70.7
  Bottom Layer w0.3: J1.11 22.86,45.78 22.86,46.66 23.11,46.91 40.89,46.91 42.67,48.69 42.67,66.73 43.31,67.36 43.31,92.63 44.58,93.9 八路灰度传感器.6
PB3: length 71.2
  Bottom Layer w0.3: J1.12 25.59,45.64 42.42,45.64 43.56,46.79 43.56,63.81 45.97,66.22 45.97,80.19 44.58,81.58 44.58,92.38 47.12,94.92 八路灰度传感器.5
PB4: length 80.6
  Top Layer w0.3: v3(44.32,60.76) 21.84,60.76 20.95,59.87 20.95,43.48 21.36,43.08 J1.13
  Bottom Layer w0.3: v3(44.32,60.76) 44.58,61.01 44.58,63.3 46.74,65.46 46.74,85.14 49.66,88.06 八路灰度传感器.4
PB5: length 78.1
  Top Layer w0.3: v3(28.96,62.79) 42.67,62.79 44.58,64.69 44.58,73.2 45.37,74 v3(47.5,74) ; v3(27.94,58.47) 27.94,43.48 27.53,43.08 J1.14
  Bottom Layer w0.3: v3(47.5,74) 47.59,74.09 50.29,74.09 53.72,77.52 53.72,93.27 52.32,94.67 52.32,96.7 八路灰度传感器.3 ; v3(28.96,62.79) 27.94,61.77 v3(27.94,58.47)
PB6: length 90.5
  Top Layer w0.3: v3(29.84,44.5) 29.84,55.8 30.86,56.82 42.04,56.82 45.34,60.12 v3(45.34,69.27) ; v3(54.48,76.12) v3(44.96,76.12)
  Bottom Layer w0.3: J1.19 23.02,36.15 23.62,36.75 28.96,36.75 29.84,37.64 v3(29.84,44.5) ; v3(54.48,76.12) 54.74,76.38 八路灰度传感器.2 ; v3(44.96,76.12) 44.45,75.62 44.45,70.16 v3(45.34,69.27)
PB7: length 90.7
  Bottom Layer w0.3: 八路灰度传感器.1 57.28,92.38 60.58,89.08 60.58,68.63 55.37,63.42 47.12,63.42 45.47,61.77 45.47,40.69 40.23,35.46 J1.20
PB8: length 127.5
  Bottom Layer w0.3: J1.21 22.89,33.04 20.93,33.04 19.81,31.93 19.81,16.69 23.34,13.16 62.56,13.16 62.87,13.46 62.87,39.8 68.83,45.77 84.2,45.77 85.11,46.68 85.11,59 6050.1
PB9: length 81.4
  Top Layer w0.3: v3(16.13,53.39) 17.4,52.12 17.4,35.36 18.67,34.09 v3(20.57,34.09)
  Bottom Layer w0.3: v3(20.57,34.09) 24.38,34.09 25.56,32.92 J1.22 ; 蜂鸣器.2 5.42,90.18 5.42,88.15 5.21,87.94 2.29,87.94 1.27,86.92 1.27,58.85 1.65,58.47 10.41,58.47 10.54,58.34 10.54,57.37 10.84,57.07 14.35,57.07 16.13,55.3 v3(16.13,53.39)
PB10: length 41.5
  Top Layer w0.3: v3(16.76,30.4) 22.99,30.4 J1.23 ; v3(7.37,50.09) 7.37,44.75 9.27,42.85 13.67,42.85 13.97,42.55 13.97,31.17 v3(14.61,30.53)
  Bottom Layer w0.3: v3(16.76,30.4) 16.64,30.53 v3(14.61,30.53) ; 10.54,55.8 9.14,55.8 7.37,54.03 v3(7.37,50.09)
PB11: length 39.9
  Top Layer w0.3: v3(8.38,49.83) 8.38,44.63 9.14,43.87 14.35,43.87 14.73,43.48 14.73,32.94 v3(14.61,32.82) ; v3(16.76,32.31) 19.94,32.31 20.7,31.55 24.39,31.55 J1.24
  Bottom Layer w0.3: v3(8.38,49.83) 8.38,52.63 9.02,53.26 10.54,53.26 ; v3(14.61,32.82) 15.11,32.31 v3(16.76,32.31)
PB12: length 40.6
  Top Layer w0.3: LED指示1.2 10.66,50.6 10.54,50.72 ; J1.25 17.05,27.84 15.75,29.13 15.75,48.82 v3(16,49.07)
  Bottom Layer w0.3: v3(16,49.07) 16,51.74 15.75,51.99 11.81,51.99 10.54,50.72
PB13: length 36.8
  Top Layer w0.3: v3(30.48,11.74) 30.48,25.45 28.1,27.84 J1.26
  Bottom Layer w0.3: L298N1.2 16.13,12.37 22.48,12.37 23.37,11.48 30.23,11.48 v3(30.48,11.74)
PB14: length 25.8
  Top Layer w0.3: J1.27 21.56,25.3 20.7,24.44 20.7,13.89 19.18,12.37 v3(13.59,12.37)
  Bottom Layer w0.3: v3(13.59,12.37) 11.05,12.37 L298N1.4
PB15: length 50.6
  Top Layer w0.3: L298N2.2 62.23,9.71 62.23,11.14 61.77,11.61 37.76,11.61 37.34,12.03 v3(37.34,14.02)
  Bottom Layer w0.3: J1.28 35.46,25.3 37.34,23.42 v3(37.34,14.02)
PB16: length 45.1
  Top Layer w0.3: L298N2.4 35.94,9.7 35.24,10.4 v3(35.24,14.15)
  Bottom Layer w0.3: v3(35.24,14.15) 35.24,19.93 33.66,21.51 24.26,21.51 J1.29
PB17: length 51.5
  Top Layer w0.3: v3(54.48,58.09) 54.99,58.6 55.63,58.6 55.88,58.85 v3(55.88,65.84)
  Bottom Layer w0.3: v3(54.48,58.09) 54.36,57.96 54.36,25.96 53.69,25.3 J2.28 ; v3(55.88,65.84) 55.88,69.16 55.89,69.17 55.89,71.03 54.74,72.19
PB18: length 58.7
  Top Layer w0.3: v3(59.82,70.41) 59.82,66.22 v3(59.44,65.84)
  Bottom Layer w0.3: 57.28,72.19 58.55,72.19 59.82,70.92 v3(59.82,70.41) ; v3(59.44,65.84) 55.5,61.9 55.5,25.32 54.23,24.05 49.53,24.05 J2.27
PB19: length 47.3
  Top Layer w0.3: v3(53.34,64.19) v3(53.34,62.28)
  Bottom Layer w0.3: v3(53.34,64.19) 53.34,69.16 53.35,69.17 53.35,71.03 SPI.5 ; J2.26 50.93,27.74 52.96,27.74 53.34,28.12 v3(53.34,62.28)
PB20: length 76.9
  Top Layer w0.3: v3(34.04,40.56) 33.4,41.2 v3(33.4,51.99) ; v3(36.83,36.37) 36.83,32.44 38.89,30.38 J2.23
  Bottom Layer w0.3: 电机1.4 3.3,66.22 6.48,63.04 26.42,63.04 27.56,64.19 31.75,64.19 33.4,62.53 v3(33.4,51.99) ; v3(36.83,36.37) 36.83,37.77 v3(34.04,40.56)
PB21: length 80.1
  Top Layer w0.3: v3(35.43,40.69) 34.67,41.45 v3(34.67,52.12) ; v3(43.05,40.06) 45.47,37.64 45.47,32.44 46.23,31.67 50.04,31.67 50.83,32.47 J2.22
  Bottom Layer w0.3: 电机1.3 4.32,67.23 4.32,66.6 5.33,65.58 31.88,65.58 34.67,62.79 v3(34.67,52.12) ; v3(35.43,40.69) 36.07,40.06 v3(43.05,40.06)
PB22: length 70.3
  Top Layer w0.3: v3(63.75,34.34) 63.43,34.02 49.4,34.02 J2.21
  Bottom Layer w0.3: v3(63.75,34.34) 63.75,36.12 64.39,36.75 80.26,36.75 87.88,44.37 87.88,58.85 90.04,61.01 电机2.4
PB23: length 62.9
  Top Layer w0.3: J2.20 65,35.46 v3(65.02,35.48)
  Bottom Layer w0.3: v3(65.02,35.48) 80.65,35.48 89.15,43.99 89.15,55.55 92.07,58.47 电机2.3
PB24: length 50.6
  Top Layer w0.3: v3(41.91,35.61) 38.23,39.29 v3(29.08,39.29)
  Bottom Layer w0.3: v3(41.91,35.61) 42.07,35.46 J2.19 ; 电机3.4 6.48,46.15 9.14,43.48 13.59,43.48 14.48,42.6 15.49,42.6 18.8,39.29 v3(29.08,39.29)
PB25: length 51.8
  Top Layer w0.3: v3(43.94,41.71) 47.12,41.71 J2.15 ; v3(28.83,41.71) v3(31.88,41.71)
  Bottom Layer w0.3: v3(28.83,41.71) 18.29,41.71 17.4,42.6 17.4,46.53 15.62,48.31 2.54,48.31 电机3.3 ; v3(31.88,41.71) v3(43.94,41.71)
PB26: length 52.6
  Top Layer w0.3: v3(90.55,45.98) 53.74,45.98 J2.14
  Bottom Layer w0.3: 电机4.4 94.91,40.31 94.62,40.61 94.62,45.26 93.9,45.98 v3(90.55,45.98)
PB27: length 57.1
  Top Layer w0.3: J2.13 48.29,42.69 49.15,41.83 51.94,41.83 54.82,44.71 v3(91.69,44.71)
  Bottom Layer w0.3: 电机4.3 94.36,37.77 93.47,38.66 93.47,44.5 93.26,44.71 v3(91.69,44.71)
$1N2660: length 2
  Top Layer w0.5: R41k4.1 89.66,16.78
$1N2663: length 2
  Top Layer w0.5: LED12.2 95.25,16.77 R41k1.1
$1N2664: length 2.3
  Top Layer w0.5: R41k2.1 79,15.03 LED15.2
$1N2665: length 2
  Top Layer w0.5: R41k3.1 72.9,17.12 LED16.2
$1N3106: length 1.8
  Top Layer w0.5: R41k5.1 66.68,17.35 66.69,17.36
$1N3187: length 2.1
  Top Layer w0.5: LED18.2 59.95,15.67 R41k6.1
$1N6143: length 2.3
  Top Layer w0.3: R247.2 92.41,66.09 3.3V指示灯.2
$1N6144: length 2
  Top Layer w1.2: R11000.2 91.97,96.76 92.04,96.69
$1N6148: length 2.4
  Top Layer w0.8: 5V指示灯.2 92.54,70.28 R3470.2
$1N7398: length 20.9
  Top Layer w1.2: D2.2 67.29,93.5 65.28,91.49 65.28,78.66 64.64,78.03 63.13,78.03 INT+1.1

## Copper pours and planes (outline as drawn; the poured copper is in the pictures)
GND on Top Layer: -6.48,104.06 103.38,104.06 106.17,101.27 106.17,83.74 106.04,83.62 89.66,83.62 89.15,83.11 81.41,83.11 80.39,84.12 80.39,89.69 67.84,89.69 67.44,90.09 67.44,76.5 68.83,75.11 80.14,75.11 80.39,75.36 80.39,81.69 90.03,81.69 91.31,82.98 105.28,82.98 113.16,75.11 113.16,2.59 105.41,-5.16 -3.17,-5.16 -4.57,-3.76 -4.57,102.16
GND on Bottom Layer: -7.87,104.32 102.49,104.32 108.59,98.22 108.59,85.27 106.81,83.49 90.17,83.49 89.66,82.98 80.9,82.98 80.65,83.24 80.65,89.33 80.26,89.71 68.45,89.71 68.33,89.84 67.18,88.7 67.18,77.39 69.09,75.49 83.02,75.49 82.64,75.87 80.26,75.87 81.41,77.01 81.41,81.84 82.17,82.6 106.17,82.6 106.17,-4.78 103.89,-7.06 -12.19,-7.06 -12.19,100
GND on Inner2: -7.87,102.03 105.28,102.03 108.33,98.98 108.33,87.55 103.5,82.73 80.65,82.73 80.39,83.74 80.01,89.59 79.63,89.97 67.18,89.97 67.18,76.15 67.97,75.36 80.52,75.36 80.52,82.14 106.93,82.14 106.93,-1.85 104.78,-4.01 -8.76,-4.01 -9.65,-3.12 -9.65,100.25
(no net) on Inner1: -12.95,106.86 -8.89,102.79 107.19,102.79 107.19,84.63 105.79,83.24 81.94,83.24 80.26,84.11 80.26,88.44 78.61,90.09 66.8,90.09 66.8,75.36 66.93,75.23 79.46,75.23 80.9,76.67 80.9,82.47 106.68,82.47 107.19,82.98 107.19,-6.55 105.16,-8.59 -12.19,-8.59 -12.95,-7.82

Small or netless copper shapes (teardrops, artwork), in the pictures only: 186 on Top Layer, 128 on Bottom Layer, 105 on Inner1, 15 on Inner2

## Text on the board
Top Silkscreen Layer: INT4 | INT3 | INT2 | INT1 | 3.3v | CS | POCI | PICO | SCLK | SW9 | 5V | A | B | M32 | M12 | M11 | M31 | 3.3V | 3V3 | 12V | GND | M42 | M22 | M41 | M21 | LITOG3507 | LM2596S | L298N | MPU6050 | 地 | 单片机RX | 单片机TX | 采用12V转5V/开 | 不外接5V用降压 | 不采用12V转5V/关 | 独立外接5V | 按键2 | 按键3 | 按键4 | 按键5 | 按键6
